# EAGLE schematic main_board_schematic (EAGLE 9.6.2)
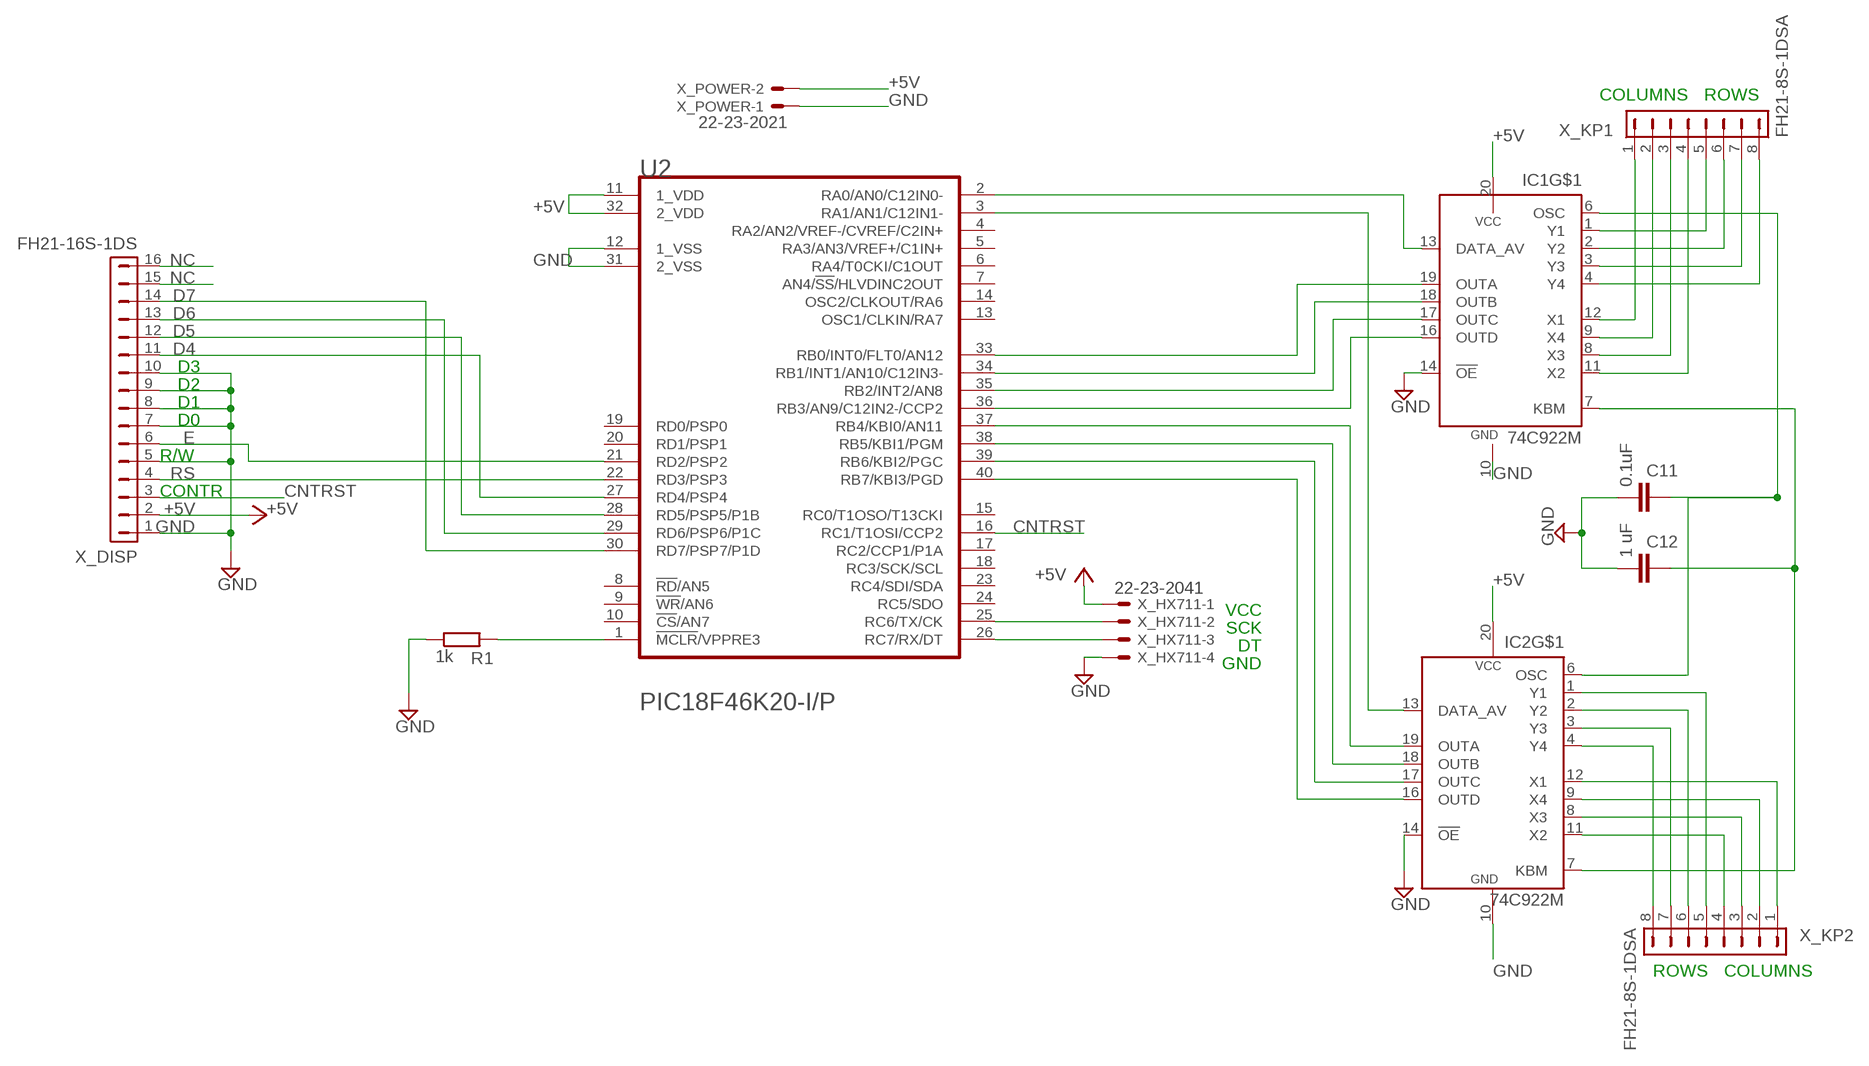
[diagram p0: schematic, sheet 1]

## Parts
C11  0.1uF  C2.5/2  [C2.5-2]
C12  1 uF  C2.5/2  [C2.5-2]
IC1  74C922M  [SO20W]
IC2  74C922M  [SO20W]
R1  1k  R-EU_R0603  [R0603]
U2  MICROCHIP_PIC18F46K20-I-PMICROCHIP_PIC18F46K20-I-P_0_0  [MICROCHIP_PIC18F46K20-I-P_0]
X_DISP  FH21-16S-1DS  [FH21-16S-1DS]
X_HX711  22-23-2041  [22-23-2041]
X_KP1  FH21-8S-1DSA  [FH21-8S-1DSA]
X_KP2  FH21-8S-1DSA  [FH21-8S-1DSA]
X_POWER  22-23-2021  [22-23-2021]

## Nets
+5V: IC1.20(P:VCC) IC2.20(P:VCC) U2.11(1_VDD) U2.32(2_VDD) X_DISP.2 X_HX711.1 X_POWER.2
CNTRST: U2.16(RC1/T1OSI/CCP2) X_DISP.3
D4: U2.27(RD4/PSP4) X_DISP.11
D5: U2.28(RD5/PSP5/P1B) X_DISP.12
D6: U2.29(RD6/PSP6/P1C) X_DISP.13
D7: U2.30(RD7/PSP7/P1D) X_DISP.14
E: U2.21(RD2/PSP2) X_DISP.6
GND: C11.2 C12.2 IC1.10(P:GND) IC1.14(!OE) IC2.10(P:GND) IC2.14(!OE) R1.1 U2.12(1_VSS) U2.31(2_VSS) X_DISP.1 X_DISP.5 X_DISP.7 X_DISP.8 X_DISP.9 X_DISP.10 X_HX711.4 X_POWER.1
N$1: U2.26(RC7/RX/DT) X_HX711.3
N$2: IC2.12(X1) X_KP2.1
N$3: IC2.9(X4) X_KP2.2
N$4: IC2.8(X3) X_KP2.3
N$5: IC2.11(X2) X_KP2.4
N$6: IC2.1(Y1) X_KP2.5
N$7: IC2.2(Y2) X_KP2.6
N$8: IC2.3(Y3) X_KP2.7
N$9: IC2.4(Y4) X_KP2.8
N$10: IC1.12(X1) X_KP1.1
N$11: IC1.16(OUTD) U2.36(RB3/AN9/C12IN2-/CCP2)
N$12: IC1.9(X4) X_KP1.2
N$13: IC1.8(X3) X_KP1.3
N$14: IC1.11(X2) X_KP1.4
N$15: U2.25(RC6/TX/CK) X_HX711.2
N$16: IC1.17(OUTC) U2.35(RB2/INT2/AN8)
N$17: IC1.18(OUTB) U2.34(RB1/INT1/AN10/C12IN3-)
N$18: IC1.19(OUTA) U2.33(RB0/INT0/FLT0/AN12)
N$19: IC2.19(OUTA) U2.37(RB4/KBI0/AN11)
N$20: IC2.18(OUTB) U2.38(RB5/KBI1/PGM)
N$21: IC2.17(OUTC) U2.39(RB6/KBI2/PGC)
N$22: IC2.16(OUTD) U2.40(RB7/KBI3/PGD)
N$23: IC1.1(Y1) X_KP1.5
N$24: IC1.2(Y2) X_KP1.6
N$25: IC1.3(Y3) X_KP1.7
N$26: IC1.4(Y4) X_KP1.8
N$27: R1.2 U2.1(!MCLR!/VPPRE3)
N$28: C11.1 IC1.6(OSC) IC2.6(OSC)
N$29: C12.1 IC1.7(KBM) IC2.7(KBM)
N$45: IC1.13(DATA_AV) U2.2(RA0/AN0/C12IN0-)
N$60: IC2.13(DATA_AV) U2.3(RA1/AN1/C12IN1-)
NC: X_DISP.15 X_DISP.16
RS: U2.22(RD3/PSP3) X_DISP.4
Unconnected: U2.4(RA2/AN2/VREF-/CVREF/C2IN+) U2.5(RA3/AN3/VREF+/C1IN+) U2.6(RA4/T0CKI/C1OUT) U2.7(AN4/!SS!/HLVDINC2OUT) U2.8(!RD!/AN5) U2.9(!WR!/AN6) U2.10(!CS!/AN7) U2.13(OSC1/CLKIN/RA7) U2.14(OSC2/CLKOUT/RA6) U2.15(RC0/T1OSO/T13CKI) U2.17(RC2/CCP1/P1A) U2.18(RC3/SCK/SCL) U2.19(RD0/PSP0) U2.20(RD1/PSP1) U2.23(RC4/SDI/SDA) U2.24(RC5/SDO)

## Notes on the sheet
- COLUMNS | ROWS
- D3
- D2
- D1
- D0
- R/W
- CONTR
- VCC
- SCK
- DT
- GND
- ROWS | COLUMNS

## Library data of the parts
C11 C12 = capacitor-wima:C: CAPACITOR naming: grid - package width
IC1 IC2 = 74xx-eu_ff:74C922: 16-Key Encoder Source: http://www.national.com/ds/MM/MM54C922.pdf#page=1
R1 = rcl:R-EU_: RESISTOR, European symbol; SPICEPREFIX: R
U2 = P:MICROCHIP_PIC18F46K20-I-P: MC-8B-18F45K20-IL40; CIIVA_IDS: 1156701; DATASHEET_VERSION: revF, Sep-2009; FOOTPRINT_VARIANT_NAME_0: Manufacturer Recommended; IMPORTED: yes; IMPORTED_FROM: vault; IMPORT_TS: 1521846864; MF: Microchip; MPN: PIC18F46K20-I/P; PACKAGE: PDIP600-P40; PACKAGE_DESCRIPTION: 40-Lead Plastic Dual In-Line (P) - 600 mil Body [PDIP]; PACKAGE_VERSION: revBB, Aug-2009; PREFIX: U; RELEASE_DATE: 1300262623; VAULT_GUID: 62ADF5D1-6D2B-4FDE-90F0-0F8BF26695C1; VAULT_REVISION: 3C46FF8B-A334-4966-A067-8205D2A13521
X_DISP = con-hirose:FH21-16S-1DS: FPC CONNECTOR Source: con-hirose.lbr from Bob Starr <rtzaudio@mindspring.com>; OC_FARNELL: unknown; OC_NEWARK: unknown
X_HX711 = con-molex:22-23-2041: .100" (2.54mm) Center Header - 4 Pin; MF: MOLEX; MPN: 22-23-2041; OC_FARNELL: 1462920; OC_NEWARK: 38C0355
X_KP1 X_KP2 = con-hirose:FH21-8S-1DSA: FPC CONNECTOR Source: con-hirose.lbr from Bob Starr <rtzaudio@mindspring.com>; OC_FARNELL: unknown; OC_NEWARK: unknown
X_POWER = con-molex:22-23-2021: .100" (2.54mm) Center Header - 2 Pin; MF: MOLEX; MPN: 22-23-2021; OC_FARNELL: 1462926; OC_NEWARK: 25C3832